# EAGLE schematic A13-OLinuXino-MICRO_Rev_A (EAGLE 4.16)
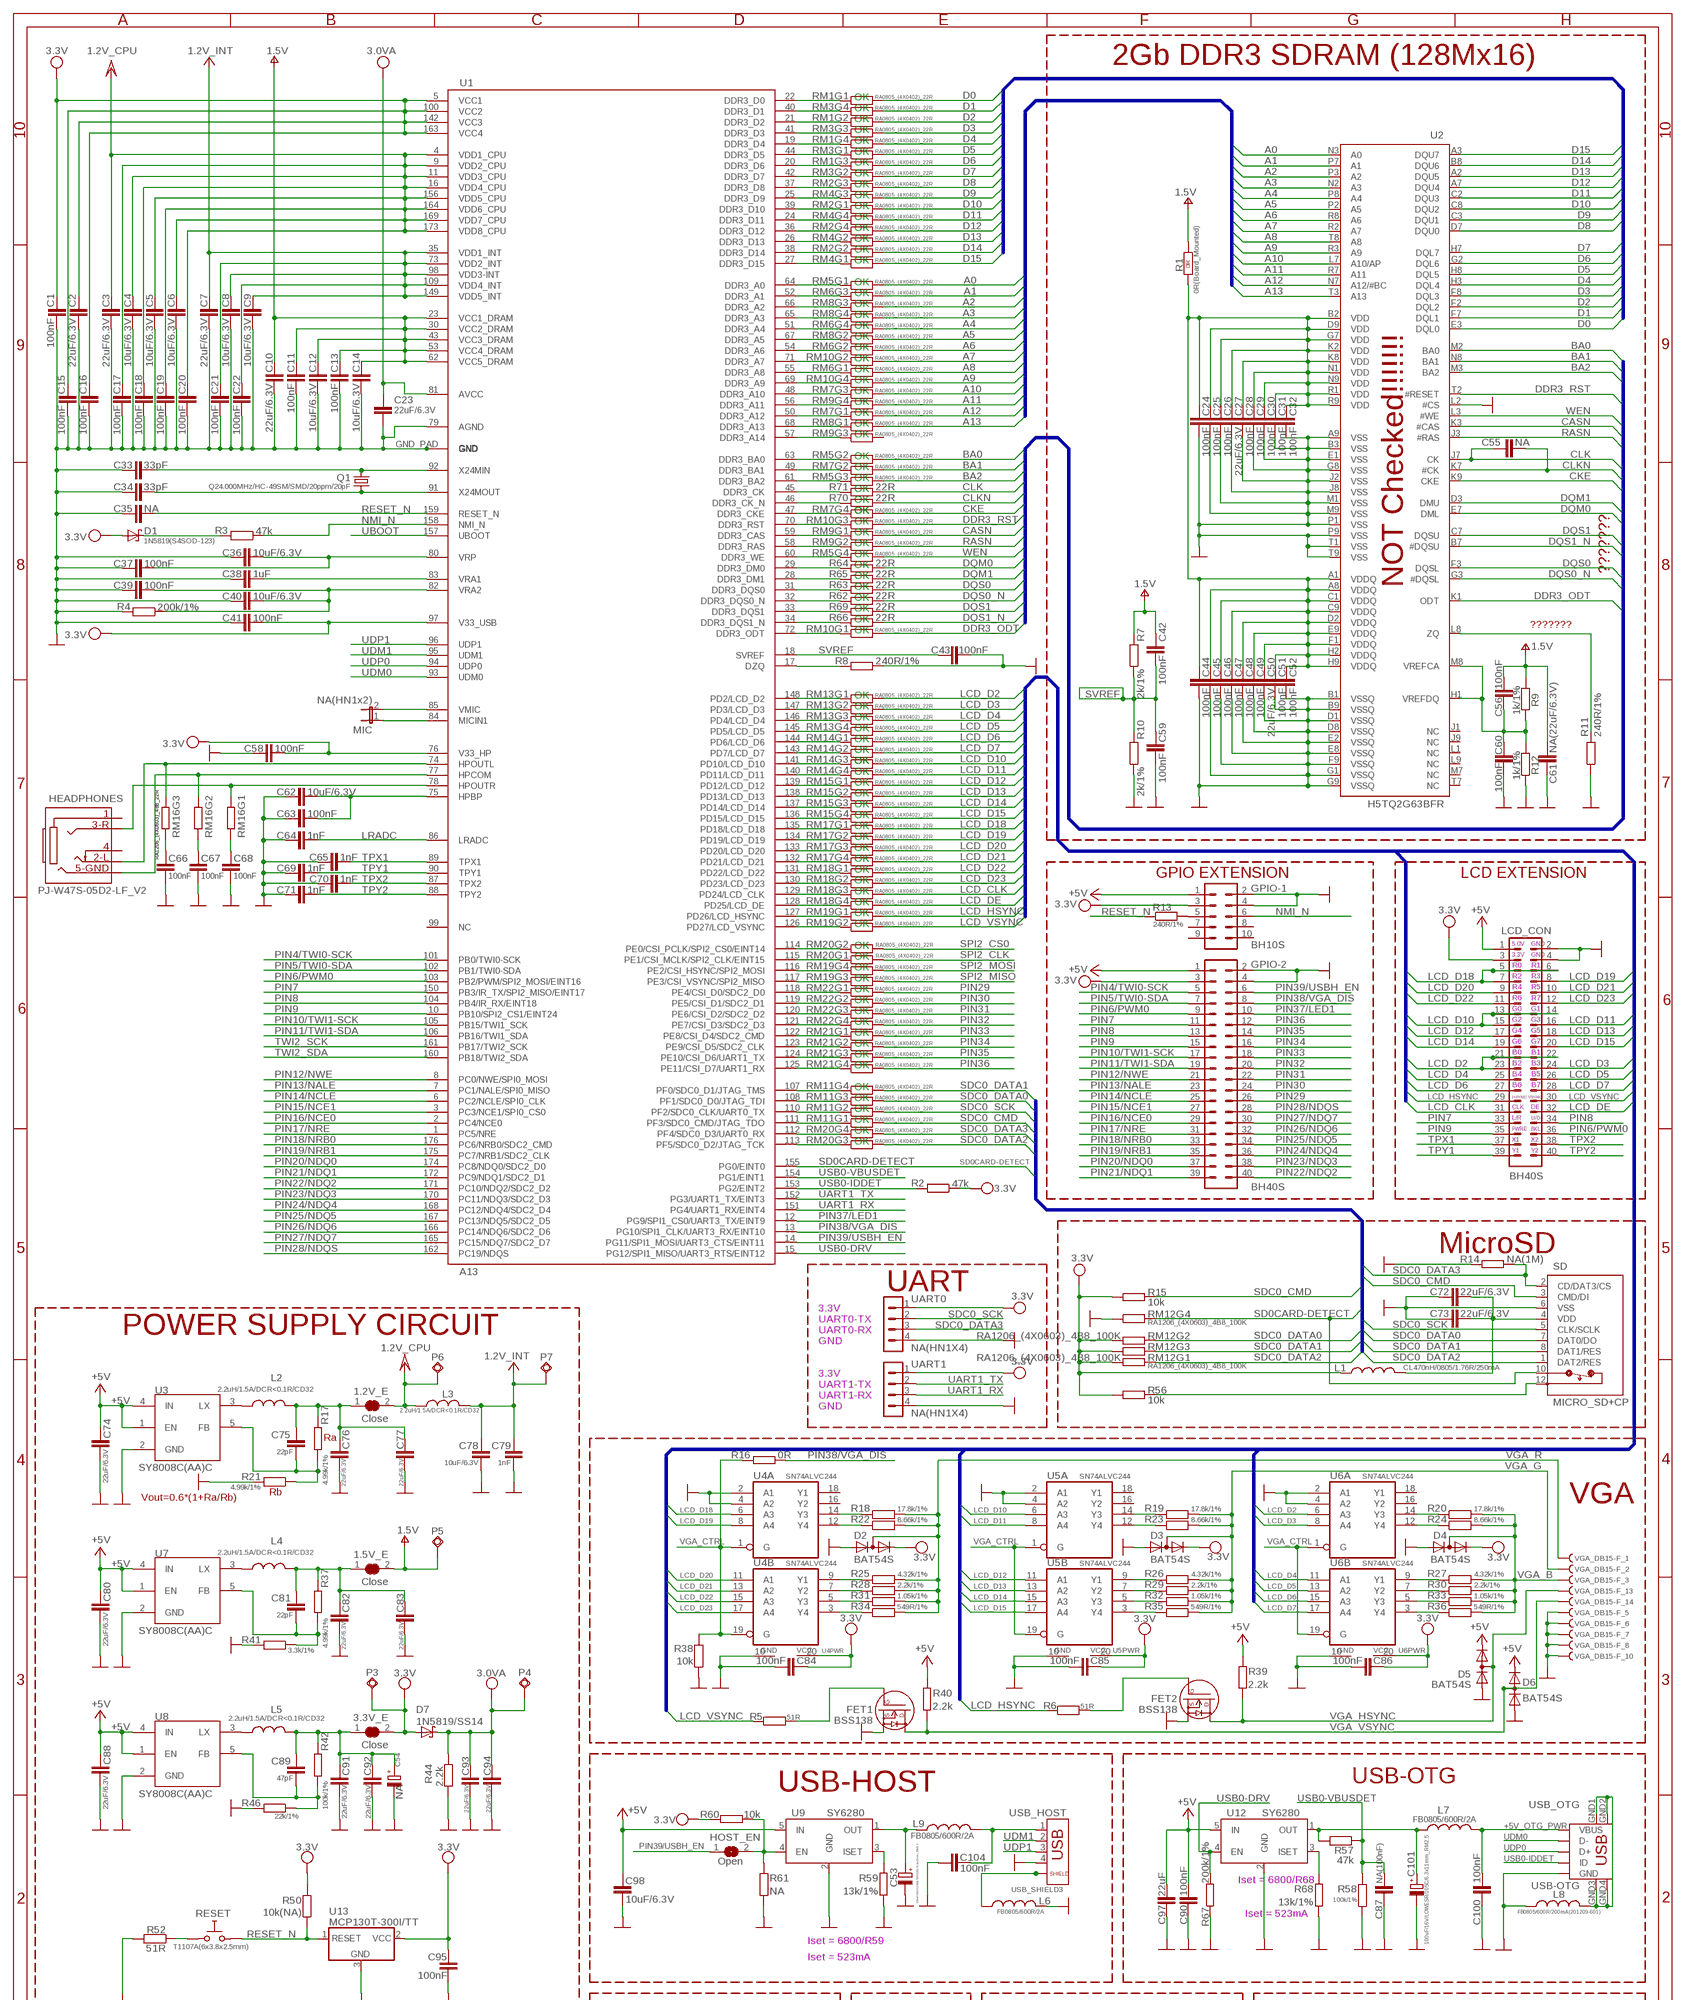
[diagram p0: schematic, sheet 1, part 1 of 2]
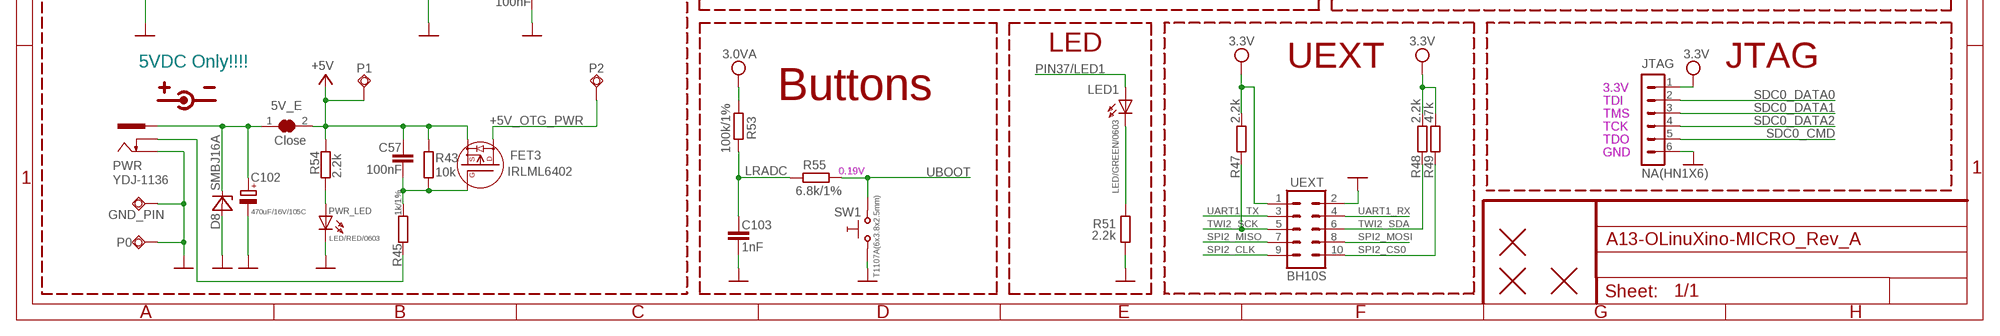
[diagram p1: schematic, sheet 1, part 2 of 2]

## Parts
1.2V_E  Close  SJSJ_1_SMALLER_CLOSE  [SJ_1_SMALLER_CLOSE]
1.5V_E  Close  SJSJ_1_SMALLER_CLOSE  [SJ_1_SMALLER_CLOSE]
3.3V_E  Close  SJSJ_1_SMALLER_CLOSE  [SJ_1_SMALLER_CLOSE]
5V_E  Close  SJSJ_SMALLER  [SJ_1_SMALLER]
C1  100nF  C-EUC0603_DWS  [C0603_DWS]
C2  22uF/6.3V  C-EUC0603_DWS  [C0603_DWS]
C3  22uF/6.3V  C-EUC0603_DWS  [C0603_DWS]
C4  10uF/6.3V  C-EUC0603_DWS  [C0603_DWS]
C5  10uF/6.3V  C-EUC0603_DWS  [C0603_DWS]
C6  10uF/6.3V  C-EUC0603_DWS  [C0603_DWS]
C7  22uF/6.3V  C-EUC0603_DWS  [C0603_DWS]
C8  10uF/6.3V  C-EUC0603_DWS  [C0603_DWS]
C9  10uF/6.3V  C-EUC0603_DWS  [C0603_DWS]
C10  22uF/6.3V  C-EUC0603_DWS  [C0603_DWS]
C11  100nF  C-EUC0603_DWS  [C0603_DWS]
C12  10uF/6.3V  C-EUC0603_DWS  [C0603_DWS]
C13  100nF  C-EUC0603_DWS  [C0603_DWS]
C14  10uF/6.3V  C-EUC0603_DWS  [C0603_DWS]
C15  100nF  C-EUC0603_DWS  [C0603_DWS]
C16  100nF  C-EUC0603_DWS  [C0603_DWS]
C17  100nF  C-EUC0603_DWS  [C0603_DWS]
C18  100nF  C-EUC0603_DWS  [C0603_DWS]
C19  100nF  C-EUC0603_DWS  [C0603_DWS]
C20  100nF  C-EUC0603_DWS  [C0603_DWS]
C21  100nF  C-EUC0603_DWS  [C0603_DWS]
C22  100nF  C-EUC0603_DWS  [C0603_DWS]
C23  22uF/6.3V  C-EUC0603_DWS  [C0603_DWS]
C24  100nF  C-EUC0603_DWS  [C0603_DWS]
C25  100nF  C-EUC0603_DWS  [C0603_DWS]
C26  100nF  C-EUC0603_DWS  [C0603_DWS]
C27  22uF/6.3V  C-EUC0603_DWS  [C0603_DWS]
C28  100nF  C-EUC0603_DWS  [C0603_DWS]
C29  100nF  C-EUC0603_DWS  [C0603_DWS]
C30  100nF  C-EUC0603_DWS  [C0603_DWS]
C31  100nF  C-EUC0603_DWS  [C0603_DWS]
C32  100nF  C-EUC0603_DWS  [C0603_DWS]
C33  33pF  C-EUC0603_DWS  [C0603_DWS]
C34  33pF  C-EUC0603_DWS  [C0603_DWS]
C35  NA  C-EUC0603_DWS  [C0603_DWS]
C36  10uF/6.3V  C-EUC0603_DWS  [C0603_DWS]
C37  100nF  C-EUC0603_DWS  [C0603_DWS]
C38  1uF  C-EUC0603_DWS  [C0603_DWS]
C39  100nF  C-EUC0603_DWS  [C0603_DWS]
C40  10uF/6.3V  C-EUC0603_DWS  [C0603_DWS]
C41  100nF  C-EUC0603_DWS  [C0603_DWS]
C42  100nF  C-EUC0603_DWS  [C0603_DWS]
C43  100nF  C-EUC0603_DWS  [C0603_DWS]
C44  100nF  C-EUC0603_DWS  [C0603_DWS]
C45  100nF  C-EUC0603_DWS  [C0603_DWS]
C46  100nF  C-EUC0603_DWS  [C0603_DWS]
C47  100nF  C-EUC0603_DWS  [C0603_DWS]
C48  100nF  C-EUC0603_DWS  [C0603_DWS]
C49  100nF  C-EUC0603_DWS  [C0603_DWS]
C50  22uF/6.3V  C-EUC0603_DWS  [C0603_DWS]
C51  100nF  C-EUC0603_DWS  [C0603_DWS]
C52  100nF  C-EUC0603_DWS  [C0603_DWS]
C53  100uF/16V/LOWESR/105C/6.3x11mm_RM2.5  CPOL-EUE2.5-6.3  [E2,5-6,3]
C54  NA  CPOL-EUE3.5-8  [E3,5-8]
C55  NA  C-EUC0603_DWS  [C0603_DWS]
C56  100nF  C-EUC0603_DWS  [C0603_DWS]
C57  100nF  C-EUC0603_DWS  [C0603_DWS]
C58  100nF  C-EUC0603_DWS  [C0603_DWS]
C59  100nF  C-EUC0603_DWS  [C0603_DWS]
C60  100nF  C-EUC0603_DWS  [C0603_DWS]
C61  NA(22uF/6.3V)  C-EUC0603_DWS  [C0603_DWS]
C62  10uF/6.3V  C-EUC0603_DWS  [C0603_DWS]
C63  100nF  C-EUC0603_DWS  [C0603_DWS]
C64  1nF  C-EUC0603_DWS  [C0603_DWS]
C65  1nF  C-EUC0603_DWS  [C0603_DWS]
C66  100nF  C-EUC0603_DWS  [C0603_DWS]
C67  100nF  C-EUC0603_DWS  [C0603_DWS]
C68  100nF  C-EUC0603_DWS  [C0603_DWS]
C69  1nF  C-EUC0603_DWS  [C0603_DWS]
C70  1nF  C-EUC0603_DWS  [C0603_DWS]
C71  1nF  C-EUC0603_DWS  [C0603_DWS]
C72  22uF/6.3V  C-EUC0603_DWS  [C0603_DWS]
C73  22uF/6.3V  C-EUC0603_DWS  [C0603_DWS]
C74  22uF/6.3V  C-EUC0603_DWS  [C0603_DWS]
C75  22pF  C-EUC0603_DWS  [C0603_DWS]
C76  22uF/6.3V  C-EUC0603_DWS  [C0603_DWS]
C77  22uF/6.3V  C-EUC0603_DWS  [C0603_DWS]
C78  10uF/6.3V  C-EUC0603_DWS  [C0603_DWS]
C79  1nF  C-EUC0603_DWS  [C0603_DWS]
C80  22uF/6.3V  C-EUC0603_DWS  [C0603_DWS]
C81  22pF  C-EUC0603_DWS  [C0603_DWS]
C82  22uF/6.3V  C-EUC0603_DWS  [C0603_DWS]
C83  22uF/6.3V  C-EUC0603_DWS  [C0603_DWS]
C84  100nF  C-EUC0603_DWS  [C0603_DWS]
C85  100nF  C-EUC0603_DWS  [C0603_DWS]
C86  100nF  C-EUC0603_DWS  [C0603_DWS]
C87  NA(100nF)  C-EUC0603_DWS  [C0603_DWS]
C88  22uF/6.3V  C-EUC0603_DWS  [C0603_DWS]
C89  47pF  C-EUC0603_DWS  [C0603_DWS]
C90  100nF  C-EUC0603_DWS  [C0603_DWS]
C91  22uF/6.3V  C-EUC0603_DWS  [C0603_DWS]
C92  22uF/6.3V  C-EUC0603_DWS  [C0603_DWS]
C93  22uF/6.3V  C-EUC0603_DWS  [C0603_DWS]
C94  22uF/6.3V  C-EUC0603_DWS  [C0603_DWS]
C95  100nF  C-EUC0603_DWS  [C0603_DWS]
C97  22uF  C-EUC0603_DWS  [C0603_DWS]
C98  10uF/6.3V  C-EUC0603_DWS  [C0603_DWS]
C100  100nF  C-EUC0603_DWS  [C0603_DWS]
C101  100uF/16V/LOWESR/105C/6.3x11mm_RM2.5  CPOL-EUE2.5-6.3  [E2,5-6,3]
C102  470uF/16V/105C  CPOL-EUE3.5-8  [E3,5-8]
C103  1nF  C-EUC0603_DWS  [C0603_DWS]
C104  100nF  C-EUC0603_DWS  [C0603_DWS]
D1  1N5819(S4SOD-123)  SCHOTKKY7.62SS-1N5819(S4SOD-123)  [SOD-123]
D2  BAT54S  DIODE_AC-AC_  [SOT23C(BAT54S)]
D3  BAT54S  DIODE_AC-AC_  [SOT23C(BAT54S)]
D4  BAT54S  DIODE_AC-AC_  [SOT23C(BAT54S)]
D5  BAT54S  DIODE_AC-AC_  [SOT23C(BAT54S)]
D6  BAT54S  DIODE_AC-AC_  [SOT23C(BAT54S)]
D7  1N5819/SS14  SCHOTKKY7.62SS2  [MLL-41]
D8  SMBJ16A  [DO214AA]
FET1  BSS138  N-MOS+DIODBSS138  [SOT23]
FET2  BSS138  N-MOS+DIODBSS138  [SOT23]
FET3  IRLML6402  P-MOS+DIODIRLML6402  [SOT23]
GND_PIN  TESTPAD3  [TEST_PAD40/70/SQUARE]
GPIO-1  BH10S  ML10  [ML10-MALE]
GPIO-2  BH40S  ML40  [ML40]
HEADPHONES  PJ-W47S-05D2-LF_V2  AUDIO_JACK_5PINPJ-W47S-05D2-LF_V2  [PJ-W47S-05D2-LF_5PIN_V2]
HOST_EN  Open  SJSJ_SMALLER  [SJ_1_SMALLER]
JTAG  NA(HN1X6)  CON6HN1X6  [HN1X6]
L1  CL470nH/0805/1.76R/250mA  L-USL0805_5MIL_DWS  [L0805_5MIL_DWS]
L2  2.2uH/1.5A/DCR<0.1R/CD32  L-CD32  [CD32]
L3  2.2uH/1.5A/DCR<0.1R/CD32  L-CD32  [CD32]
L4  2.2uH/1.5A/DCR<0.1R/CD32  L-CD32  [CD32]
L5  2.2uH/1.5A/DCR<0.1R/CD32  L-CD32  [CD32]
L6  FB0805/600R/2A  L-USL0805_5MIL_DWS  [L0805_5MIL_DWS]
L7  FB0805/600R/2A  L-USL0805_5MIL_DWS  [L0805_5MIL_DWS]
L8  FB0805/600R/200mA(201209-601)  L-USL0805_5MIL_DWS  [L0805_5MIL_DWS]
L9  FB0805/600R/2A  L-USL0805_5MIL_DWS  [L0805_5MIL_DWS]
LCD_CON  BH40S  ML40  [ML40]
LED1  LED/GREEN/0603  LED0603DWS  [LED-0603]
MIC  NA(HN1x2)  JP1E  [JP1]
P0  TESTPADTESTPAD_40-ROUND  [TESTPAD_40-ROUND]
P1  TESTPADTESTPAD_40-ROUND  [TESTPAD_40-ROUND]
P2  TESTPADTESTPAD_40-ROUND  [TESTPAD_40-ROUND]
P3  TESTPADTESTPAD_40-ROUND  [TESTPAD_40-ROUND]
P4  TESTPADTESTPAD_40-ROUND  [TESTPAD_40-ROUND]
P5  TESTPADTESTPAD_40-ROUND  [TESTPAD_40-ROUND]
P6  TESTPADTESTPAD_40-ROUND  [TESTPAD_40-ROUND]
P7  TESTPADTESTPAD_40-ROUND  [TESTPAD_40-ROUND]
PWR  YDJ-1136  PWR-JAKPWR_JACK_UNI_MILLING  [PWR_JACK_UNI_MILLING]
PWR_LED  LED/RED/0603  LED0603DWS  [LED-0603]
Q1  Q24.000MHz/HC-49SM/SMD/20ppm/20pF  HC49/S1  [HC49/SMD2_THIN]
R1  0R(Board_Mounted)  R_0R0R(NA)  [0603_0R]
R2  47k  R-EU_R0603_5MIL_DWS  [R0603_5MIL_DWS]
R3  47k  R-EU_R0603_5MIL_DWS  [R0603_5MIL_DWS]
R4  200k/1%  R-EU_R0603_5MIL_DWS  [R0603_5MIL_DWS]
R5  51R  R-EU_R0603_5MIL_DWS  [R0603_5MIL_DWS]
R6  51R  R-EU_R0603_5MIL_DWS  [R0603_5MIL_DWS]
R7  2k/1%  R-EU_R0603_5MIL_DWS  [R0603_5MIL_DWS]
R8  240R/1%  R-EU_R0603_5MIL_DWS  [R0603_5MIL_DWS]
R9  1k/1%  R-EU_R0603_5MIL_DWS  [R0603_5MIL_DWS]
R10  2k/1%  R-EU_R0603_5MIL_DWS  [R0603_5MIL_DWS]
R11  240R/1%  R-EU_R0603_5MIL_DWS  [R0603_5MIL_DWS]
R12  1k/1%  R-EU_R0603_5MIL_DWS  [R0603_5MIL_DWS]
R13  240R/1%  R-EU_R0603_5MIL_DWS  [R0603_5MIL_DWS]
R14  NA(1M)  R-EU_R0603_5MIL_DWS  [R0603_5MIL_DWS]
R15  10k  R-EU_R0603_5MIL_DWS  [R0603_5MIL_DWS]
R16  0R  R-EU_R0603_5MIL_DWS  [R0603_5MIL_DWS]
R17  4.99k/1%  R-EU_R0603_5MIL_DWS  [R0603_5MIL_DWS]
R18  17.8k/1%  R-EU_R0603_5MIL_DWS  [R0603_5MIL_DWS]
R19  17.8k/1%  R-EU_R0603_5MIL_DWS  [R0603_5MIL_DWS]
R20  17.8k/1%  R-EU_R0603_5MIL_DWS  [R0603_5MIL_DWS]
R21  4.99k/1%  R-EU_R0603_5MIL_DWS  [R0603_5MIL_DWS]
R22  8.66k/1%  R-EU_R0603_5MIL_DWS  [R0603_5MIL_DWS]
R23  8.66k/1%  R-EU_R0603_5MIL_DWS  [R0603_5MIL_DWS]
R24  8.66k/1%  R-EU_R0603_5MIL_DWS  [R0603_5MIL_DWS]
R25  4.32k/1%  R-EU_R0603_5MIL_DWS  [R0603_5MIL_DWS]
R26  4.32k/1%  R-EU_R0603_5MIL_DWS  [R0603_5MIL_DWS]
R27  4.32k/1%  R-EU_R0603_5MIL_DWS  [R0603_5MIL_DWS]
R28  2.2k/1%  R-EU_R0603_5MIL_DWS  [R0603_5MIL_DWS]
R29  2.2k/1%  R-EU_R0603_5MIL_DWS  [R0603_5MIL_DWS]
R30  2.2k/1%  R-EU_R0603_5MIL_DWS  [R0603_5MIL_DWS]
R31  1.05k/1%  R-EU_R0603_5MIL_DWS  [R0603_5MIL_DWS]
R32  1.05k/1%  R-EU_R0603_5MIL_DWS  [R0603_5MIL_DWS]
R33  1.05k/1%  R-EU_R0603_5MIL_DWS  [R0603_5MIL_DWS]
R34  549R/1%  R-EU_R0603_5MIL_DWS  [R0603_5MIL_DWS]
R35  549R/1%  R-EU_R0603_5MIL_DWS  [R0603_5MIL_DWS]
R36  549R/1%  R-EU_R0603_5MIL_DWS  [R0603_5MIL_DWS]
R37  4.99k/1%  R-EU_R0603_5MIL_DWS  [R0603_5MIL_DWS]
R38  10k  R-EU_R0603_5MIL_DWS  [R0603_5MIL_DWS]
R39  2.2k  R-EU_R0603_5MIL_DWS  [R0603_5MIL_DWS]
R40  2.2k  R-EU_R0603_5MIL_DWS  [R0603_5MIL_DWS]
R41  3.3k/1%  R-EU_R0603_5MIL_DWS  [R0603_5MIL_DWS]
R42  100k/1%  R-EU_R0603_5MIL_DWS  [R0603_5MIL_DWS]
R43  10k  R-EU_R0603_5MIL_DWS  [R0603_5MIL_DWS]
R44  2.2k  R-EU_R0603_5MIL_DWS  [R0603_5MIL_DWS]
R45  1k/1%  R-EU_R0603_5MIL_DWS  [R0603_5MIL_DWS]
R46  22k/1%  R-EU_R0603_5MIL_DWS  [R0603_5MIL_DWS]
R47  2.2k  R-EU_R0603_5MIL_DWS  [R0603_5MIL_DWS]
R48  2.2k  R-EU_R0603_5MIL_DWS  [R0603_5MIL_DWS]
R49  47k  R-EU_R0603_5MIL_DWS  [R0603_5MIL_DWS]
R50  10k(NA)  R-EU_R0603_5MIL_DWS  [R0603_5MIL_DWS]
R51  2.2k  R-EU_R0603_5MIL_DWS  [R0603_5MIL_DWS]
R52  51R  R-EU_R0603_5MIL_DWS  [R0603_5MIL_DWS]
R53  100k/1%  R-EU_R0603_5MIL_DWS  [R0603_5MIL_DWS]
R54  2.2k  R-EU_R0603_5MIL_DWS  [R0603_5MIL_DWS]
R55  6.8k/1%  R-EU_R0603_5MIL_DWS  [R0603_5MIL_DWS]
R56  10k  R-EU_R0603_5MIL_DWS  [R0603_5MIL_DWS]
R57  47k  R-EU_R0603_5MIL_DWS  [R0603_5MIL_DWS]
R58  100k/1%  R-EU_R0603_5MIL_DWS  [R0603_5MIL_DWS]
R59  13k/1%  R-EU_R0603_5MIL_DWS  [R0603_5MIL_DWS]
R60  10k  R-EU_R0603_5MIL_DWS  [R0603_5MIL_DWS]
R61  NA  R-EU_R0603_5MIL_DWS  [R0603_5MIL_DWS]
R62  22R  R-EU_R0603_5MIL_DWS  [R0603_5MIL_DWS]
R63  22R  R-EU_R0603_5MIL_DWS  [R0603_5MIL_DWS]
R64  22R  R-EU_R0603_5MIL_DWS  [R0603_5MIL_DWS]
R65  22R  R-EU_R0603_5MIL_DWS  [R0603_5MIL_DWS]
R66  22R  R-EU_R0603_5MIL_DWS  [R0603_5MIL_DWS]
R67  200k/1%  R-EU_R0603_5MIL_DWS  [R0603_5MIL_DWS]
R68  13k/1%  R-EU_R0603_5MIL_DWS  [R0603_5MIL_DWS]
R69  22R  R-EU_R0603_5MIL_DWS  [R0603_5MIL_DWS]
R70  22R  R-EU_R0603_5MIL_DWS  [R0603_5MIL_DWS]
R71  22R  R-EU_R0603_5MIL_DWS  [R0603_5MIL_DWS]
RESET  T1107A(6x3.8x2.5mm)  SW-TAKT6  [SW-TAKT_6X3.5_SMD]
RM1  RA0805_(4X0402)_22R  R_MATRIX_4ER_MATRIX_4_0402  [R_MATRIX_4_0402]
RM2  RA0805_(4X0402)_22R  R_MATRIX_4ER_MATRIX_4_0402  [R_MATRIX_4_0402]
RM3  RA0805_(4X0402)_22R  R_MATRIX_4ER_MATRIX_4_0402  [R_MATRIX_4_0402]
RM4  RA0805_(4X0402)_22R  R_MATRIX_4ER_MATRIX_4_0402  [R_MATRIX_4_0402]
RM5  RA0805_(4X0402)_22R  R_MATRIX_4ER_MATRIX_4_0402  [R_MATRIX_4_0402]
RM6  RA0805_(4X0402)_22R  R_MATRIX_4ER_MATRIX_4_0402  [R_MATRIX_4_0402]
RM7  RA0805_(4X0402)_22R  R_MATRIX_4ER_MATRIX_4_0402  [R_MATRIX_4_0402]
RM8  RA0805_(4X0402)_22R  R_MATRIX_4ER_MATRIX_4_0402  [R_MATRIX_4_0402]
RM9  RA0805_(4X0402)_22R  R_MATRIX_4ER_MATRIX_4_0402  [R_MATRIX_4_0402]
RM10  RA0805_(4X0402)_22R  R_MATRIX_4ER_MATRIX_4_0402  [R_MATRIX_4_0402]
RM11  RA0805_(4X0402)_22R  R_MATRIX_4ER_MATRIX_4_0402  [R_MATRIX_4_0402]
RM12  RA1206_(4X0603)_4B8_100K  R_MATRIX_4E  [R_MATRIX_4]
RM13  RA0805_(4X0402)_22R  R_MATRIX_4ER_MATRIX_4_0402  [R_MATRIX_4_0402]
RM14  RA0805_(4X0402)_22R  R_MATRIX_4ER_MATRIX_4_0402  [R_MATRIX_4_0402]
RM15  RA0805_(4X0402)_22R  R_MATRIX_4ER_MATRIX_4_0402  [R_MATRIX_4_0402]
RM16  RA1206_(4X0603)_4B8_22R  R_MATRIX_4E  [R_MATRIX_4]
RM17  RA0805_(4X0402)_22R  R_MATRIX_4ER_MATRIX_4_0402  [R_MATRIX_4_0402]
RM18  RA0805_(4X0402)_22R  R_MATRIX_4ER_MATRIX_4_0402  [R_MATRIX_4_0402]
RM19  RA0805_(4X0402)_22R  R_MATRIX_4ER_MATRIX_4_0402  [R_MATRIX_4_0402]
RM20  RA0805_(4X0402)_22R  R_MATRIX_4ER_MATRIX_4_0402  [R_MATRIX_4_0402]
RM21  RA0805_(4X0402)_22R  R_MATRIX_4ER_MATRIX_4_0402  [R_MATRIX_4_0402]
RM22  RA0805_(4X0402)_22R  R_MATRIX_4ER_MATRIX_4_0402  [R_MATRIX_4_0402]
SD  MICRO_SD+CP  MICRO_SD/MMC_CPMICRO  [TFR-MEM-CON]
SW1  T1107A(6x3.8x2.5mm)  SW-TAKT6  [SW-TAKT_6X3.5_SMD]
U1  A13  [TQFP176]
U2  H5TQ2G63BFR  [FBGA96]
U3  SY8008C(AA)C  SY8008  [SOT23-5]
U4  SN74ALVC244  74ALVC244  [PW]
U5  SN74ALVC244  74ALVC244  [PW]
U6  SN74ALVC244  74ALVC244  [PW]
U7  SY8008C(AA)C  SY8008  [SOT23-5]
U8  SY8008C(AA)C  SY8008  [SOT23-5]
U9  SY6280  [SOT23-5]
U12  SY6280  [SOT23-5]
U13  MCP130T-300I/TT  RESETMCP130T-300-I/TT  [SOT23]
U$1  FIDUCIAL1X2  [FIDUCIAL-1X2]
U$2  FIDUCIAL1X2  [FIDUCIAL-1X2]
U$3  FIDUCIAL1X2  [FIDUCIAL-1X2]
UART0  NA(HN1X4)  CON4HN1X4  [HN1X4]
UART1  NA(HN1X4)  CON4HN1X4  [HN1X4]
UEXT  BH10S  ML10  [ML10-MALE]
USB_HOST  USB_SHIELD3  [USB_PN87520_HOST_PTH]
USB_OTG  USB-OTG  MINI_USB9  [USB_MINI_9PIN]
VGA_DB15-F  VGA15  DB1522  [DB15-F_22MM]

## Nets
+5V: 5V_E.2 C57.1 C74.1 C80.1 C88.1 C90.1 C97.1 C98.1 D5.2(K) D6.2(K) FET3.2(S) GPIO-1.1 GPIO-2.1 LCD_CON.1 P1.1(PP) R39.2 R40.2 R43.2 R54.1 U3.1(EN) U3.4(IN) U7.1(EN) U7.4(IN) U8.1(EN) U8.4(IN) U9.5(IN) U12.5(IN)
+5V_OTG_PWR: C100.1 FET3.3(D) L7.1 P2.1(PP) USB_OTG.VBUS
A0: RM5.1.2 U2.N3(A0)
A1: RM6.3.2 U2.P7(A1)
A2: RM8.3.2 U2.P3(A2)
A3: RM8.4.2 U2.N2(A3)
A4: RM6.4.2 U2.P8(A4)
A5: RM8.2.2 U2.P2(A5)
A6: RM6.2.2 U2.R8(A6)
A7: RM10.2.2 U2.R2(A7)
A8: RM6.1.2 U2.T8(A8)
A9: RM10.4.2 U2.R3(A9)
A10: RM7.3.2 U2.L7(A10/AP)
A11: RM9.4.2 U2.R7(A11)
A12: RM7.1.2 U2.N7(A12/#BC)
A13: RM8.1.2 U2.T3(A13)
BA0: RM5.2.2 U2.M2(BA0)
BA1: RM7.2.2 U2.N8(BA1)
BA2: RM5.3.2 U2.M3(BA2)
CASN: RM9.1.2 U2.K3(#CAS)
CKE: RM7.4.2 U2.K9(CKE)
CLK: C55.1 R71.1 U2.J7(CK)
CLKN: C55.2 R70.1 U2.K7(#CK)
D0: RM1.1.2 U2.E3(DQL0)
D1: RM3.4.2 U2.F7(DQL1)
D2: RM1.2.2 U2.F2(DQL2)
D3: RM3.3.2 U2.F8(DQL3)
D4: RM1.4.2 U2.H3(DQL4)
D5: RM3.1.2 U2.H8(DQL5)
D6: RM1.3.2 U2.G2(DQL6)
D7: RM3.2.2 U2.H7(DQL7)
D8: RM2.3.2 U2.D7(DQU0)
D9: RM4.3.2 U2.C3(DQU1)
D10: RM2.1.2 U2.C8(DQU2)
D11: RM4.4.2 U2.C2(DQU3)
D12: RM2.4.2 U2.A7(DQU4)
D13: RM4.2.2 U2.A2(DQU5)
D14: RM2.2.2 U2.B8(DQU6)
D15: RM4.1.2 U2.A3(DQU7)
DDR3_A0: RM5.1.1 U1.64(DDR3_A0)
DDR3_A1: RM6.3.1 U1.52(DDR3_A1)
DDR3_A2: RM8.3.1 U1.66(DDR3_A2)
DDR3_A3: RM8.4.1 U1.65(DDR3_A3)
DDR3_A4: RM6.4.1 U1.51(DDR3_A4)
DDR3_A5: RM8.2.1 U1.67(DDR3_A5)
DDR3_A6: RM6.2.1 U1.54(DDR3_A6)
DDR3_A7: RM10.2.1 U1.71(DDR3_A7)
DDR3_A8: RM6.1.1 U1.55(DDR3_A8)
DDR3_A9: RM10.4.1 U1.69(DDR3_A9)
DDR3_A10: RM7.3.1 U1.48(DDR3_A10)
DDR3_A11: RM9.4.1 U1.56(DDR3_A11)
DDR3_A12: RM7.1.1 U1.50(DDR3_A12)
DDR3_A13: RM8.1.1 U1.68(DDR3_A13)
DDR3_A14: RM9.3.1 U1.57(DDR3_A14)
DDR3_BA0: RM5.2.1 U1.63(DDR3_BA0)
DDR3_BA1: RM7.2.1 U1.49(DDR3_BA1)
DDR3_BA2: RM5.3.1 U1.61(DDR3_BA2)
DDR3_CAS: RM9.1.1 U1.59(DDR3_CAS)
DDR3_CK: R71.2 U1.45(DDR3_CK)
DDR3_CK_N: R70.2 U1.46(DDR3_CK_N)
DDR3_CKE: RM7.4.1 U1.47(DDR3_CKE)
DDR3_D0: RM1.1.1 U1.22(DDR3_D0)
DDR3_D1: RM3.4.1 U1.40(DDR3_D1)
DDR3_D2: RM1.2.1 U1.21(DDR3_D2)
DDR3_D3: RM3.3.1 U1.41(DDR3_D3)
DDR3_D4: RM1.4.1 U1.19(DDR3_D4)
DDR3_D5: RM3.1.1 U1.44(DDR3_D5)
DDR3_D6: RM1.3.1 U1.20(DDR3_D6)
DDR3_D7: RM3.2.1 U1.42(DDR3_D7)
DDR3_D8: RM2.3.1 U1.37(DDR3_D8)
DDR3_D9: RM4.3.1 U1.25(DDR3_D9)
DDR3_D10: RM2.1.1 U1.39(DDR3_D10)
DDR3_D11: RM4.4.1 U1.24(DDR3_D11)
DDR3_D12: RM2.4.1 U1.36(DDR3_D12)
DDR3_D13: RM4.2.1 U1.26(DDR3_D13)
DDR3_D14: RM2.2.1 U1.38(DDR3_D14)
DDR3_D15: RM4.1.1 U1.27(DDR3_D15)
DDR3_DM0: R64.2 U1.29(DDR3_DM0)
DDR3_DM1: R65.2 U1.28(DDR3_DM1)
DDR3_DQS0: R63.2 U1.31(DDR3_DQS0)
DDR3_DQS0_N: R62.2 U1.32(DDR3_DQS0_N)
DDR3_DQS1: R69.2 U1.33(DDR3_DQS1)
DDR3_DQS1_N: R66.2 U1.34(DDR3_DQS1_N)
DDR3_ODT: RM10.1.2 U2.K1(ODT)
DDR3_ODTT: RM10.1.1 U1.72(DDR3_ODT)
DDR3_RAS: RM9.2.1 U1.58(DDR3_RAS)
DDR3_RST: RM10.3.2 U2.T2(#RESET)
DDR3_RSTT: RM10.3.1 U1.70(DDR3_RST)
DDR3_WE: RM5.4.1 U1.60(DDR3_WE)
DQM0: R64.1 U2.E7(DML)
DQM1: R65.1 U2.D3(DMU)
DQS0: R63.1 U2.F3(DQSL)
DQS0_N: R62.1 U2.G3(#DQSL)
DQS1: R69.1 U2.C7(DQSU)
DQS1_N: R66.1 U2.B7(#DQSU)
DZQ: R8.2 U1.17(DZQ)
GND [PWR]: C1.1 C2.1 C3.1 C4.1 C5.1 C6.1 C7.1 C8.1 C9.1 C10.1 C11.1 C12.1 C13.1 C14.1 C15.1 C16.1 C17.1 C18.1 C19.1 C20.1 C21.1 C22.1 C23.1 C24.2 C25.2 C26.2 C27.2 C28.2 C29.2 C30.2 C31.2 C32.2 C33.1 C34.1 C35.1 C36.1 C37.1 C38.1 C39.1 C40.1 C41.1 C43.1 C44.2 C45.2 C46.2 C47.2 C48.2 C49.2 C50.2 C51.2 C52.2 C53.- C54.- C58.1 C59.1 C60.1 C61.1 C62.1 C63.1 C64.1 C65.1 C66.1 C67.1 C68.1 C69.1 C70.1 C71.1 C72.1 C73.1 C74.2 C76.2 C77.2 C78.2 C79.2 C80.2 C82.2 C83.2 C84.2 C85.2 C86.2 C87.2 C88.2 C90.2 C91.2 C92.2 C93.2 C94.2 C95.2 C97.2 C98.2 C100.2 C101.- C102.- C103.2 C104.2 D2.1(A) D3.1(A) D4.1(A) D5.1(A) D6.1(A) D8.A FET1.2(S) FET2.2(S) GND_PIN.P$1(PP) GPIO-1.2 GPIO-1.4 GPIO-2.2 GPIO-2.4 JTAG.6 L6.1 L8.1 LCD_CON.2 LCD_CON.4 P0.1(PP) PWR.- PWR_LED.C R4.2 R8.1 R10.1 R11.1 R12.1 R14.2 R21.2 R38.1 R41.2 R44.2 R46.2 R51.1 R52.2 R58.1 R59.1 R61.1 R67.1 R68.1 RM12.4.1 SD.6(VSS) SW1.P$1 U1.79(AGND) U1.GND_PAD(GND) U1.P$2(GND) U1.P$3(GND) U1.P$4(GND) U1.P$5(GND) U1.P$6(GND) U1.P$7(GND) U1.P$8(GND) U1.P$9(GND) U1.P$10(GND) U1.P$11(GND) U1.P$12(GND) U1.P$13(GND) U1.P$14(GND) U1.P$15(GND) U1.P$16(GND) U1.P$17(GND) U1.P$18(GND) U2.A9(VSS) U2.B1(VSSQ) U2.B3(VSS) U2.B9(VSSQ) U2.D1(VSSQ) U2.D8(VSSQ) U2.E1(VSS) U2.E2(VSSQ) U2.E8(VSSQ) U2.F9(VSSQ) U2.G1(VSSQ) U2.G8(VSS) U2.G9(VSSQ) U2.J2(VSS) U2.J8(VSS) U2.L2(#CS) U2.M1(VSS) U2.M9(VSS) U2.P1(VSS) U2.P9(VSS) U2.T1(VSS) U2.T9(VSS) U3.2(GND) U4.2(A:A1) U4.4(A:A2) U4.10(PWR:GND) U5.2(A:A1) U5.4(A:A2) U5.10(PWR:GND) U6.2(A:A1) U6.4(A:A2) U6.10(PWR:GND) U7.2(GND) U8.2(GND) U9.2(GND) U12.2(GND) U13.3(GND) UART0.4 UART1.4 UEXT.2 USB_HOST.4 USB_OTG.GND VGA_DB15-F.5 VGA_DB15-F.6 VGA_DB15-F.7 VGA_DB15-F.8 VGA_DB15-F.10
LCD_CLK: LCD_CON.31 RM18.3.2
LCD_D2: LCD_CON.21 LCD_CON.22 LCD_CON.23 RM13.1.2 U6.6(A:A3)
LCD_D3: LCD_CON.24 RM13.2.2 U6.8(A:A4)
LCD_D4: LCD_CON.25 RM13.3.2 U6.11(B:A1)
LCD_D5: LCD_CON.26 RM13.4.2 U6.13(B:A2)
LCD_D6: LCD_CON.27 RM14.1.2 U6.15(B:A3)
LCD_D7: LCD_CON.28 RM14.2.2 U6.17(B:A4)
LCD_D10: LCD_CON.13 LCD_CON.14 LCD_CON.15 RM14.3.2 U5.6(A:A3)
LCD_D11: LCD_CON.16 RM14.4.2 U5.8(A:A4)
LCD_D12: LCD_CON.17 RM15.1.2 U5.11(B:A1)
LCD_D13: LCD_CON.18 RM15.2.2 U5.13(B:A2)
LCD_D14: LCD_CON.19 RM15.3.2 U5.15(B:A3)
LCD_D15: LCD_CON.20 RM15.4.2 U5.17(B:A4)
LCD_D18: LCD_CON.5 LCD_CON.6 LCD_CON.7 RM17.1.2 U4.6(A:A3)
LCD_D19: LCD_CON.8 RM17.2.2 U4.8(A:A4)
LCD_D20: LCD_CON.9 RM17.3.2 U4.11(B:A1)
LCD_D21: LCD_CON.10 RM17.4.2 U4.13(B:A2)
LCD_D22: LCD_CON.11 RM18.1.2 U4.15(B:A3)
LCD_D23: LCD_CON.12 RM18.2.2 U4.17(B:A4)
LCD_DE: LCD_CON.32 RM18.4.2
LCD_HSYNC: LCD_CON.29 R6.1 RM19.1.2
LCD_VSYNC: LCD_CON.30 R5.1 RM19.2.2
LRADC: C64.2 C103.1 R53.2 R55.1 U1.86(LRADC)
MICIN1: MIC.1 U1.84(MICIN1)
N$1: C62.2 C63.2 U1.75(HPBP)
N$3: 5V_E.1 C102.+ D8.C PWR.+
N$4: L2.1 U3.3(LX)
N$6: R56.1 SD.12(PACK)
N$7: C57.2 FET3.1(G) R43.1 R45.2
N$8: L4.1 U7.3(LX)
N$9: C36.2 C37.2 U1.80(VRP)
N$10: D1.C R3.2
N$11 [PWR]: PWR.-- R45.1
N$12: FET1.1(G) R5.2
N$13: C38.2 U1.83(VRA1)
N$14: C39.2 C40.2 R4.1 U1.82(VRA2)
N$15: FET2.1(G) R6.2
N$16: C101.+ L7.2 R57.2 U12.1(OUT)
N$18: 1.5V_E.1 C81.1 C82.1 C83.1 L4.2 R37.1
N$19: C81.2 R37.2 R41.1 U7.5(FB)
N$20: R33.1 U6.5(B:Y3)
N$22: L6.2 USB_HOST.P$1 USB_HOST.P$2
N$23: 1.2V_E.1 C75.1 C76.1 C77.1 L2.2 R17.1
N$24 [PWR]: HOST_EN.2 R60.2 R61.2 U9.4(EN)
N$26: HEADPHONES.2 RM16.3.2 U1.74(HPOUTL)
N$27: HEADPHONES.5 RM16.2.2 U1.77(HPCOM)
N$28: HEADPHONES.3 RM16.1.2 U1.78(HPOUTR)
N$34: C66.2 RM16.3.1
N$35: C67.2 RM16.2.1
N$36: GPIO-1.5 R13.2
N$37: C56.2 C60.2 R9.1 R12.2 U2.H1(VREFDQ) U2.M8(VREFCA)
N$38: C75.2 R17.2 R21.1 U3.5(FB)
N$42: LED1.C R51.2
N$44: C68.2 RM16.1.1
N$46 [PWR]: R52.1 RESET.P$1
N$64: L5.1 U8.3(LX)
N$65: 3.3V_E.1 C54.+ C89.1 C91.1 C92.1 L5.2 R42.1
N$66: C89.2 R42.2 R46.1 U8.5(FB)
N$87: RM11.1.1 U1.111(PF3/SDC0_CMD/JTAG_TDO)
N$92: RM11.2.1 U1.110(PF2/SDC0_CLK/UART0_TX)
N$93: RM11.3.1 U1.108(PF1/SDC0_D0/JTAG_TDI)
N$94: RM11.4.1 U1.107(PF0/SDC0_D1/JTAG_TMS)
N$95: RM20.4.1 U1.112(PF4/SDC0_D3/UART0_RX)
N$96: RM20.3.1 U1.113(PF5/SDC0_D2/JTAG_TCK)
N$97: RM20.1.1 U1.115(PE1/CSI_MCLK/SPI2_CLK/EINT15)
N$98: RM20.2.1 U1.114(PE0/CSI_PCLK/SPI2_CS0/EINT14)
N$99: R68.2 U12.3(ISET)
N$101: R59.2 U9.3(ISET)
N$103: R36.1 U6.3(B:Y4)
N$104: R27.1 U6.9(B:Y1)
N$107: R30.1 U6.7(B:Y2)
N$108: R20.1 U6.14(A:Y3)
N$109: R24.1 U6.12(A:Y4)
N$111: C104.1 L9.2 USB_HOST.1
N$114: C53.+ L9.1 U9.1(OUT)
N$117: R26.1 U5.9(B:Y1)
N$118: R29.1 U5.7(B:Y2)
N$129: PWR_LED.A R54.2
N$136: RM13.1.1 U1.148(PD2/LCD_D2)
N$138: R32.1 U5.5(B:Y3)
N$141: RM13.2.1 U1.147(PD3/LCD_D3)
N$142: RM13.3.1 U1.146(PD4/LCD_D4)
N$143: RM13.4.1 U1.145(PD5/LCD_D5)
N$144: RM14.1.1 U1.144(PD6/LCD_D6)
N$145: RM14.2.1 U1.143(PD7/LCD_D7)
N$146: RM14.3.1 U1.141(PD10/LCD_D10)
N$147: RM14.4.1 U1.140(PD11/LCD_D11)
N$148: RM15.1.1 U1.139(PD12/LCD_D12)
N$149: RM15.2.1 U1.138(PD13/LCD_D13)
N$150: RM15.3.1 U1.137(PD14/LCD_D14)
N$151: RM15.4.1 U1.136(PD15/LCD_D15)
N$152: RM17.1.1 U1.135(PD18/LCD_D18)
N$153: RM17.2.1 U1.134(PD19/LCD_D19)
N$154: RM17.3.1 U1.133(PD20/LCD_D20)
N$155: RM17.4.1 U1.132(PD21/LCD_D21)
N$156: RM18.1.1 U1.131(PD22/LCD_D22)
N$157: RM18.2.1 U1.130(PD23/LCD_D23)
N$158: RM18.3.1 U1.129(PD24/LCD_CLK)
N$159: RM18.4.1 U1.128(PD25/LCD_DE)
N$160: RM19.1.1 U1.127(PD26/LCD_HSYNC)
N$161: RM19.2.1 U1.126(PD27/LCD_VSYNC)
N$162: RM21.4.1 U1.125(PE11/CSI_D7/UART1_RX)
N$163: RM21.3.1 U1.124(PE10/CSI_D6/UART1_TX)
N$164: RM22.2.1 U1.119(PE5/CSI_D1/SDC2_D1)
N$165: RM22.1.1 U1.118(PE4/CSI_D0/SDC2_D0)
N$166: RM19.4.1 U1.116(PE2/CSI_HSYNC/SPI2_MOSI)
N$167: RM19.3.1 U1.117(PE3/CSI_VSYNC/SPI2_MISO)
N$168: RM21.2.1 U1.123(PE9/CSI_D5/SDC2_CLK)
N$169: RM21.1.1 U1.122(PE8/CSI_D4/SDC2_CMD)
N$170: RM22.4.1 U1.121(PE7/CSI_D3/SDC2_D3)
N$171: RM22.3.1 U1.120(PE6/CSI_D2/SDC2_D2)
N$172: R35.1 U5.3(B:Y4)
N$173: R19.1 U5.14(A:Y3)
N$174: R23.1 U5.12(A:Y4)
N$177: R25.1 U4.9(B:Y1)
N$178: R28.1 U4.7(B:Y2)
N$179: R31.1 U4.5(B:Y3)
N$180: R34.1 U4.3(B:Y4)
N$181: R18.1 U4.14(A:Y3)
N$182: R22.1 U4.12(A:Y4)
N$266: L8.2 USB_OTG.GND1 USB_OTG.GND2 USB_OTG.GND3 USB_OTG.GND4
NMI_N: GPIO-1.6 R3.1 U1.158(NMI_N)
PIN4/TWI0-SCK: GPIO-2.5 U1.101(PB0/TWI0-SCK)
PIN5/TWI0-SDA: GPIO-2.7 U1.102(PB1/TWI0-SDA)
PIN6/PWM0: GPIO-2.9 LCD_CON.36 U1.103(PB2/PWM/SPI2_MOSI/EINT16)
PIN7: GPIO-2.11 LCD_CON.33 U1.150(PB3/IR_TX/SPI2_MISO/EINT17)
PIN8: GPIO-2.13 LCD_CON.34 U1.104(PB4/IR_RX/EINT18)
PIN9: GPIO-2.15 LCD_CON.35 U1.10(PB10/SPI2_CS1/EINT24)
PIN10/TWI1-SCK: GPIO-2.17 U1.105(PB15/TWI1_SCK)
PIN11/TWI1-SDA: GPIO-2.19 U1.106(PB16/TWI1_SDA)
PIN12/NWE: GPIO-2.21 U1.8(PC0/NWE/SPI0_MOSI)
PIN13/NALE: GPIO-2.23 U1.7(PC1/NALE/SPI0_MISO)
PIN14/NCLE: GPIO-2.25 U1.6(PC2/NCLE/SPI0_CLK)
PIN15/NCE1: GPIO-2.27 U1.3(PC3/NCE1/SPI0_CS0)
PIN16/NCE0: GPIO-2.29 U1.2(PC4/NCE0)
PIN17/NRE: GPIO-2.31 U1.1(PC5/NRE)
PIN18/NRB0: GPIO-2.33 U1.176(PC6/NRB0/SDC2_CMD)
PIN19/NRB1: GPIO-2.35 U1.175(PC7/NRB1/SDC2_CLK)
PIN20/NDQ0: GPIO-2.37 U1.174(PC8/NDQ0/SDC2_D0)
PIN21/NDQ1: GPIO-2.39 U1.172(PC9/NDQ1/SDC2_D1)
PIN22/NDQ2: GPIO-2.40 U1.171(PC10/NDQ2/SDC2_D2)
PIN23/NDQ3: GPIO-2.38 U1.170(PC11/NDQ3/SDC2_D3)
PIN24/NDQ4: GPIO-2.36 U1.168(PC12/NDQ4/SDC2_D4)
PIN25/NDQ5: GPIO-2.34 U1.167(PC13/NDQ5/SDC2_D5)
PIN26/NDQ6: GPIO-2.32 U1.166(PC14/NDQ6/SDC2_D6)
PIN27/NDQ7: GPIO-2.30 U1.165(PC15/NDQ7/SDC2_D7)
PIN28/NDQS: GPIO-2.28 U1.162(PC19/NDQS)
PIN29: GPIO-2.26 RM22.1.2
PIN30: GPIO-2.24 RM22.2.2
PIN31: GPIO-2.22 RM22.3.2
PIN32: GPIO-2.20 RM22.4.2
PIN33: GPIO-2.18 RM21.1.2
PIN34: GPIO-2.16 RM21.2.2
PIN35: GPIO-2.14 RM21.3.2
PIN36: GPIO-2.12 RM21.4.2
PIN37/LED1 [PWR]: GPIO-2.10 LED1.A U1.12(PG9/SPI1_CS0/UART3_TX/EINT9)
PIN38/VGA_DIS: GPIO-2.8 R16.2 U1.13(PG10/SPI1_CLK/UART3_RX/EINT10)
PIN39/USBH_EN [PWR]: GPIO-2.6 HOST_EN.1 U1.14(PG11/SPI1_MOSI/UART3_CTS/EINT11)
RASN: RM9.2.2 U2.J3(#RAS)
RESET_N: C35.2 R13.1 R50.1 RESET.P$2 U1.159(RESET_N) U13.1(RESET)
SD0CARD-DETECT: RM12.4.2 SD.10(CP_E) U1.155(PG0/EINT0)
SD_VCC: C72.2 C73.2 L1.2 SD.4(VDD)
SDC0_CMD: JTAG.5 R15.1 RM11.1.2 SD.3(CMD/DI)
SDC0_DATA0: JTAG.2 RM11.3.2 RM12.2.1 SD.7(DAT0/DO)
SDC0_DATA1: JTAG.3 RM11.4.2 RM12.3.1 SD.8(DAT1/RES)
SDC0_DATA2: JTAG.4 RM12.1.1 RM20.3.2 SD.1(DAT2/RES)
SDC0_DATA3: R14.1 RM20.4.2 SD.2(CD/DAT3/CS) UART0.3
SDC0_SCK: RM11.2.2 SD.5(CLK/SCLK) UART0.2
SPI2_CLK: RM20.1.2 UEXT.9
SPI2_CS0: R49.1 RM20.2.2 UEXT.10
SPI2_MISO: RM19.3.2 UEXT.7
SPI2_MOSI: RM19.4.2 UEXT.8
SVREF: C42.2 C43.2 C59.2 R7.1 R10.2 U1.18(SVREF)
TPX1: C65.2 LCD_CON.37 U1.89(TPX1)
TPX2: C70.2 LCD_CON.38 U1.87(TPX2)
TPY1: C69.2 LCD_CON.39 U1.90(TPY1)
TPY2: C71.2 LCD_CON.40 U1.88(TPY2)
TWI2_SCK: R47.1 U1.161(PB17/TWI2_SCK) UEXT.5
TWI2_SDA: R48.1 U1.160(PB18/TWI2_SDA) UEXT.6
UART1_RX: U1.151(PG4/UART1_RX/EINT4) UART1.3 UEXT.4
UART1_TX: U1.152(PG3/UART1_TX/EINT3) UART1.2 UEXT.3
UBOOT: R55.2 SW1.P$2 U1.157(UBOOT)
UDM0: U1.93(UDM0) USB_OTG.D-
UDM1: U1.95(UDM1) USB_HOST.2
UDP0: U1.94(UDP0) USB_OTG.D+
UDP1: U1.96(UDP1) USB_HOST.3
USB0-DRV: R67.2 U1.15(PG12/SPI1_MISO/UART3_RTS/EINT12) U12.4(EN)
USB0-IDDET: R2.2 U1.153(PG2/EINT2) USB_OTG.ID
USB0-VBUSDET: C87.1 R57.1 R58.2 U1.154(PG1/EINT1)
V+: 1.5V_E.2 C10.2 C11.2 C12.2 C13.2 C14.2 C42.1 C56.1 C61.2 P5.1(PP) R1.1(1.1) R7.2 R9.2 U1.23(VCC1_DRAM) U1.30(VCC2_DRAM) U1.43(VCC3_DRAM) U1.53(VCC4_DRAM) U1.62(VCC5_DRAM) ; supply symbol labelled 1.5V
VCC [PWR]: 3.3V_E.2 C1.2 C2.2 C15.2 C16.2 C41.2 C58.2 C84.1 C85.1 C86.1 C95.1 D1.A D2.2(K) D3.2(K) D4.2(K) D7.A GPIO-1.3 GPIO-2.3 JTAG.1 L1.1 LCD_CON.3 P3.1(PP) R2.1 R15.2 R47.2 R48.2 R49.2 R50.2 R56.2 R60.1 RM12.1.2 RM12.2.2 RM12.3.2 U1.5(VCC1) U1.76(V33_HP) U1.97(V33_USB) U1.100(VCC2) U1.142(VCC3) U1.163(VCC4) U4.20(PWR:VCC) U5.20(PWR:VCC) U6.20(PWR:VCC) U13.2(VCC) UART0.1 UART1.1 UEXT.1 ; supply symbol labelled 3.3V
VCC/2: 1.2V_E.2 C3.2 C4.2 C5.2 C6.2 C17.2 C18.2 C19.2 C20.2 L3.1 P6.1(PP) U1.4(VDD1_CPU) U1.9(VDD2_CPU) U1.11(VDD3_CPU) U1.16(VDD4_CPU) U1.156(VDD5_CPU) U1.164(VDD6_CPU) U1.169(VDD7_CPU) U1.173(VDD8_CPU) ; supply symbol labelled 1.2V_CPU
VCCINT: C7.2 C8.2 C9.2 C21.2 C22.2 C78.1 C79.1 L3.2 P7.1(PP) U1.35(VDD1_INT) U1.73(VDD2_INT) U1.98(VDD3-INT) U1.109(VDD4_INT) U1.149(VDD5_INT) ; supply symbol labelled 1.2V_INT
VDD.: C24.1 C25.1 C26.1 C27.1 C28.1 C29.1 C30.1 C31.1 C32.1 C44.1 C45.1 C46.1 C47.1 C48.1 C49.1 C50.1 C51.1 C52.1 R1.2(1.2) U2.A1(VDDQ) U2.A8(VDDQ) U2.B2(VDD) U2.C1(VDDQ) U2.C9(VDDQ) U2.D2(VDDQ) U2.D9(VDD) U2.E9(VDDQ) U2.F1(VDDQ) U2.G7(VDD) U2.H2(VDDQ) U2.H9(VDDQ) U2.K2(VDD) U2.K8(VDD) U2.N1(VDD) U2.N9(VDD) U2.R1(VDD) U2.R9(VDD)
VGA_B: D4.3(AK) R20.2 R24.2 R27.2 R30.2 R33.2 R36.2 VGA_DB15-F.3
VGA_CTRL [PWR]: R16.1 R38.2 U4.1(A:G) U4.19(B:G) U5.1(A:G) U5.19(B:G) U6.1(A:G) U6.19(B:G)
VGA_G: D3.3(AK) R19.2 R23.2 R26.2 R29.2 R32.2 R35.2 VGA_DB15-F.2
VGA_HSYNC: D5.3(AK) FET2.3(D) R39.1 VGA_DB15-F.13
VGA_R: D2.3(AK) R18.2 R22.2 R25.2 R28.2 R31.2 R34.2 VGA_DB15-F.1
VGA_VSYNC: D6.3(AK) FET1.3(D) R40.1 VGA_DB15-F.14
VMIC: MIC.2 U1.85(VMIC)
VPP [PWR]: C23.2 C93.1 C94.1 D7.K(C) P4.1(PP) R44.1 R53.1 U1.81(AVCC) ; supply symbol labelled 3.0VA
WEN: RM5.4.2 U2.L3(#WE)
XTALI: C33.2 Q1.2 U1.92(X24MIN)
XTALO: C34.2 Q1.1 U1.91(X24MOUT)
ZQ: R11.2 U2.L8(ZQ)
Unconnected: GPIO-1.7 GPIO-1.8 GPIO-1.9 GPIO-1.10 HEADPHONES.1 HEADPHONES.4 RM9.3.2 RM16.4.1 RM16.4.2 U1.99(NC) U2.J1(NC) U2.J9(NC) U2.L1(NC) U2.L9(NC) U2.M7(NC) U2.T7(NC) U4.16(A:Y2) U4.18(A:Y1) U5.16(A:Y2) U5.18(A:Y1) U6.16(A:Y2) U6.18(A:Y1) VGA_DB15-F.4 VGA_DB15-F.9 VGA_DB15-F.11 VGA_DB15-F.12 VGA_DB15-F.15

## Buses
A[0..13]
D[0..15]
SDC0_SCK,SDC0_CMD,SDC0_DATA[0..3],SD0CARD-DETECT
BA[0..2],CLK,CLKN,CKE,CS,CASN,RASN,WEN,DQM[0..1],DQS[0..1],DQS0_N,DQS1_N,DDR3_RST,DDR3_ODT
LCD_D[2..7],LCD_D[10..15],LCD_D[18..23],LCD_HSYNC,LCD_VSYNC,LCD_CLK,LCD_DE

## Notes on the sheet
- 2Gb DDR3 SDRAM (128Mx16)
- OK
- OK
- OK
- OK
- OK
- OK
- OK
- OK
- OK
- OK
- OK
- OK
- OK
- OK
- OK
- OK
- OK
- OK
- OK
- OK
- OK
- OK
- OK
- OK
- OK
- OK
- OK
- OK
- OK
- OK
- OK
- OK
- OK
- OK
- OK
- OK
- OK | OK
- OK
- OK
- OK
- OK
- OK
- ???????
- OK
- OK | NOT Checked!!!!!!!
- OK
- OK
- OK
- ???????
- OK
- OK
- OK
- OK
- OK
- OK
- OK
- OK | OK
- OK
- OK
- OK
- OK
- OK
- OK
- OK
- OK
- OK
- OK
- GPIO EXTENSION | LCD EXTENSION
- OK
- OK
- OK
- OK
- OK
- 5.0V | GND
- OK
- 3.3V | GND
- OK
- R0 | R1
- OK
- R2 | R3
- OK
- R4 | R5
- OK
- R6 | R7
- OK
- G0 | G1
- OK
- G2 | G3
- OK
- G4 | G5
- OK
- G6 | G7
- OK
- B0 | B1
- OK
- B2 | B3
- OK
- B4 | B5
- B6 | B7
- OK
- HSYNC | VSYNC
- OK
- CLK | DE
- OK
- L/R | U/D
- OK
- PWRE | BKL
- OK
- X1 | X2
- OK
- Y1 | Y2
- MicroSD
- UART
- 3.3V
- UART0-TX
- POWER SUPPLY CIRCUIT | UART0-RX
- GND
- 3.3V
- UART1-TX
- UART1-RX
- GND
- Ra
- Rb
- Vout=0.6*(1+Ra/Rb) | VGA
- USB-OTG
- USB-HOST
- Iset = 6800/R68
- Iset = 523mA
- Iset = 6800/R59
- Iset = 523mA
- LED
- 5VDC Only!!!! | UEXT | JTAG
- 3.3V
- Buttons
- TDI
- TMS
- TCK
- TDO
- GND
- 0.19V

## Power pins joined to a net without a drawn wire
GND: VGA_DB15-F.GND1 VGA_DB15-F.GND2

## Library data of the parts
1.2V_E 1.5V_E 3.3V_E 5V_E HOST_EN = jumper:SJ: SMD solder JUMPER
C1-C52 C55-C95 C97 C98 C100 C103 C104 = rcl:C-EU: CAPACITOR, European symbol
C53 C54 C101 C102 = rcl:CPOL-EU: POLARIZED CAPACITOR, European symbol
D1 D7 = gogo:SCHOTKKY7.62SS
D2-D6 = semicon-smd-ipc:DIODE_AC-AC_: DUAL DIODE
D8 = OLIMEX_DISCRET:SMBJ16A
FET1 FET2 = Penko:N-MOS+DIOD
FET3 = Penko:P-MOS+DIOD
GND_PIN P0 P1-P7 = gogo:TESTPAD: drill 40mils, diameter 70mils
GPIO-1 UEXT = con-harting-ml:ML10: HARTING
GPIO-2 LCD_CON = con-harting-ml:ML40: HARTING
HEADPHONES = gogo:AUDIO_JACK_5PIN
JTAG = Penko:CON6: CONNECTORS - 6 PINS
L1 L6-L9 = rcl:L-US: INDUCTOR, American symbol
L2-L5 = OLIMEX_DISCRET:L
LED1 PWR_LED = DOUBLE-SIDE:LED
MIC = jumper:JP1E: JUMPER
PWR = gogo:PWR-JAK
Q1 = crystal:HC49/S: CRYSTAL
R1 = OLIMEX_DISCRET:R_0R
R2-R71 = rcl:R-EU_: RESISTOR, European symbol
RESET SW1 = gogo:SW-TAKT
RM1-RM22 = OLIMEX_DISCRET:R_MATRIX_4E
SD = OLIMEX_CONNECTORS:MICRO_SD/MMC_CP
U1 = OLIMEX_IC:A13
U2 = OLIMEX_IC:H5TQ2G63BFR
U3 U7 U8 = OLIMEX_IC:SY8008
U4-U6 = 74AC244:74ALVC244
U9 U12 = OLIMEX_IC:SY6280
U13 = gogo:RESET: Microcontroller Supervisory Circuit with Open Drain Output
U$1-U$3 = SparkFunEagle-6-6-07:FIDUCIAL: Fiducial Alignment Points Various fiducial points for machine vision alignment.
UART0 UART1 = Penko:CON4
USB_HOST = OLIMEX_CONNECTORS:USB_SHIELD
USB_OTG = OLIMEX_CONNECTORS:MINI_USB9
VGA_DB15-F = OLIMEX_CONNECTORS:DB15